# EAGLE schematic midi_controller (EAGLE 9.4.1)
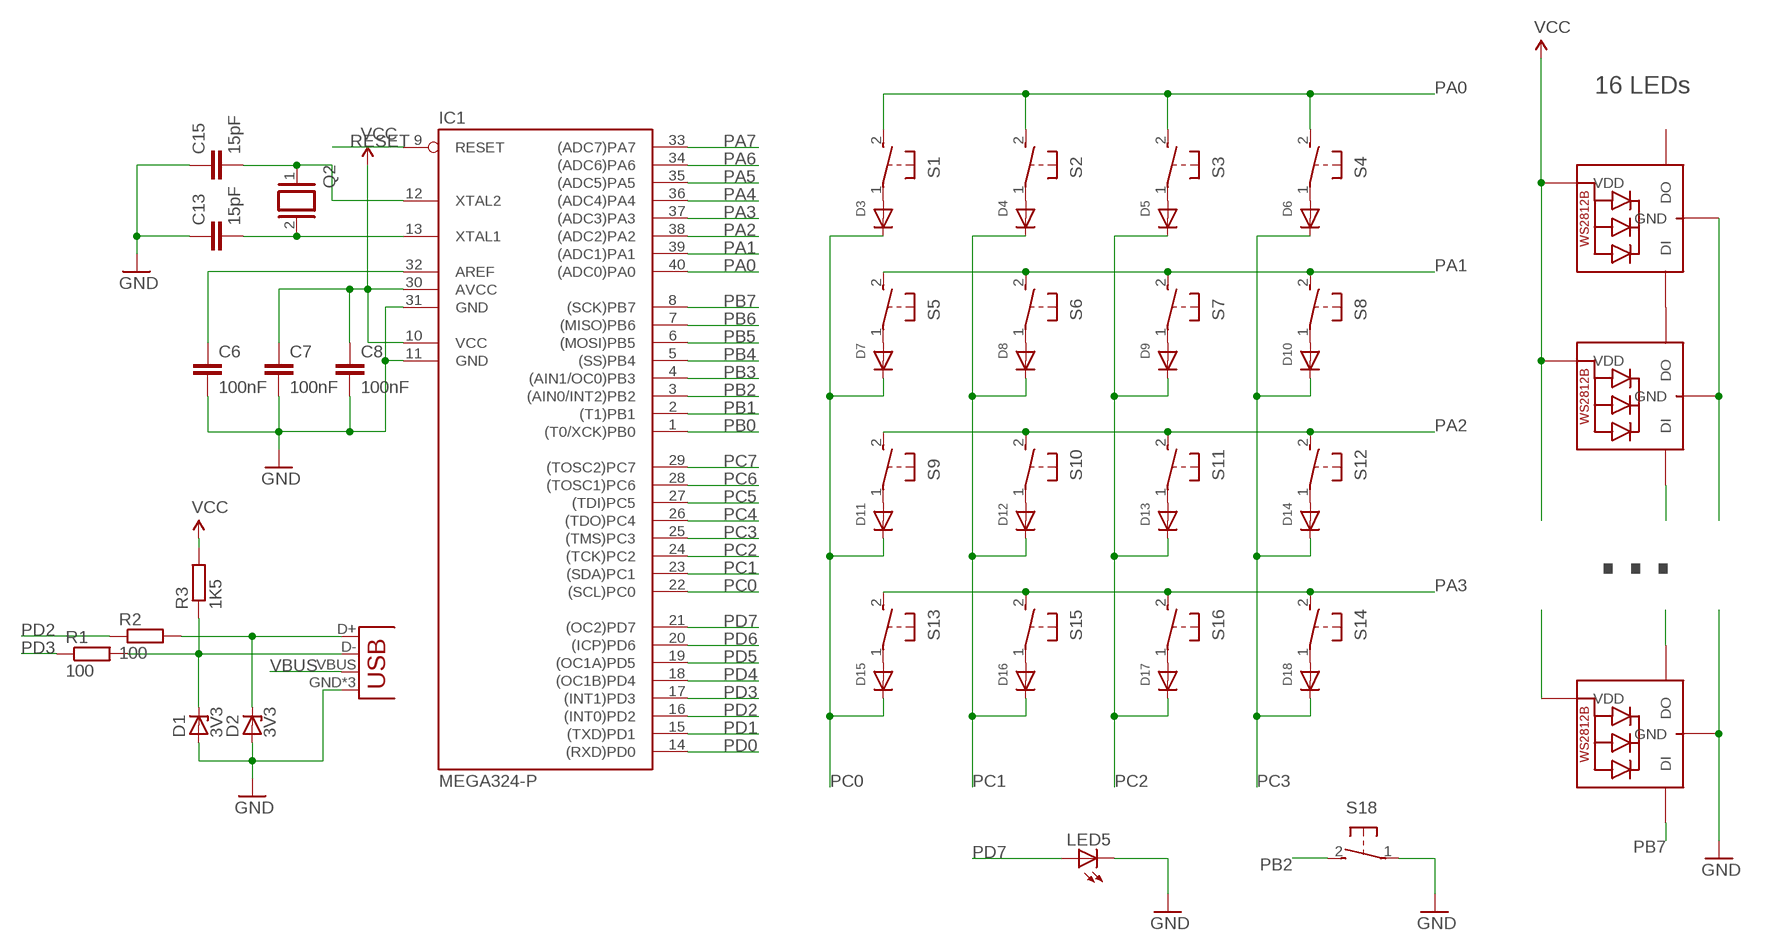
[diagram p0: schematic, sheet 1]

## Parts
C6  100nF  C-EUC_PM  [C025-025X050]
C7  100nF  C-EUC_PM  [C025-025X050]
C8  100nF  C-EUC_PM  [C025-025X050]
C13  15pF  C-EUC_PM  [C025-025X050]
C15  15pF  C-EUC_PM  [C025-025X050]
D1  3V3  ZENER-DIODEDO34-7  [DO34Z7]
D2  3V3  ZENER-DIODEDO34-7  [DO34Z7]
D3  DIODEDO-1N4148  [DO-1N4148]
D4  DIODEDO-1N4148  [DO-1N4148]
D5  DIODEDO-1N4148  [DO-1N4148]
D6  DIODEDO-1N4148  [DO-1N4148]
D7  DIODEDO-1N4148  [DO-1N4148]
D8  DIODEDO-1N4148  [DO-1N4148]
D9  DIODEDO-1N4148  [DO-1N4148]
D10  DIODEDO-1N4148  [DO-1N4148]
D11  DIODEDO-1N4148  [DO-1N4148]
D12  DIODEDO-1N4148  [DO-1N4148]
D13  DIODEDO-1N4148  [DO-1N4148]
D14  DIODEDO-1N4148  [DO-1N4148]
D15  DIODEDO-1N4148  [DO-1N4148]
D16  DIODEDO-1N4148  [DO-1N4148]
D17  DIODEDO-1N4148  [DO-1N4148]
D18  DIODEDO-1N4148  [DO-1N4148]
IC1  MEGA324-P  MEGA16-P  [DIL40]
J2  USBPTH  [USB-B-PTH]
LED1  WS2812B3535  [LED3535]
LED2  WS2812B3535  [LED3535]
LED3  WS2812B3535  [LED3535]
LED5  LED  [SMARTLED-TTW]
Q2  XTAL/S  [QS]
R1  100  R-EU_0204/7  [0204/7]
R2  100  R-EU_0204/7  [0204/7]
R3  1K5  R-EU_0204/7  [0204/7]
S1  31-XXSKINNY  [B3F-31XX-SKINNIER]
S2  31-XXSKINNY  [B3F-31XX-SKINNIER]
S3  31-XXSKINNY  [B3F-31XX-SKINNIER]
S4  31-XXSKINNY  [B3F-31XX-SKINNIER]
S5  31-XXSKINNY  [B3F-31XX-SKINNIER]
S6  31-XXSKINNY  [B3F-31XX-SKINNIER]
S7  31-XXSKINNY  [B3F-31XX-SKINNIER]
S8  31-XXSKINNY  [B3F-31XX-SKINNIER]
S9  31-XXSKINNY  [B3F-31XX-SKINNIER]
S10  31-XXSKINNY  [B3F-31XX-SKINNIER]
S11  31-XXSKINNY  [B3F-31XX-SKINNIER]
S12  31-XXSKINNY  [B3F-31XX-SKINNIER]
S13  31-XXSKINNY  [B3F-31XX-SKINNIER]
S14  31-XXSKINNY  [B3F-31XX-SKINNIER]
S15  31-XXSKINNY  [B3F-31XX-SKINNIER]
S16  31-XXSKINNY  [B3F-31XX-SKINNIER]
S18  31-XXSKINNY  [B3F-31XX-SKINNIER]

## Nets
GND: C6.2 C7.2 C8.2 C13.1 C15.1 D1.A D2.A IC1.11(GND) IC1.31(GND) J2.GND J2.P$1(GND) J2.P$2(GND) LED2.4(GND) LED5.C@1(C) S18.1(P)
N$1: LED1.3(DO) LED3.1(DI)
N$2: D3.A S1.1(P)
N$3: C6.1 IC1.32(AREF)
N$4: C13.2 IC1.13(XTAL1) Q2.2
N$5: C15.2 IC1.12(XTAL2) Q2.1
N$6: D4.A S2.1(P)
N$7: D5.A S3.1(P)
N$8: D6.A S4.1(P)
N$9: LED1.1(DI)
N$10: LED2.3(DO)
N$12: LED2.2(VDD)
N$13: C7.1 C8.1 IC1.10(VCC) IC1.30(AVCC) ; supply symbol labelled VCC
N$14: D2.C J2.D+ R2.2
N$15: D1.C J2.D- R1.2 R3.1
N$16: D7.A S5.1(P)
N$17: D8.A S6.1(P)
N$18: D9.A S7.1(P)
N$19: D10.A S8.1(P)
N$20: LED1.4(GND) LED3.4(GND)
N$21: D11.A S9.1(P)
N$22: D12.A S10.1(P)
N$23: D13.A S11.1(P)
N$24: D14.A S12.1(P)
N$26: D15.A S13.1(P)
N$27: D16.A S15.1(P)
N$28: D17.A S16.1(P)
N$29: D18.A S14.1(P)
PA0: IC1.40((ADC0)PA0) S1.2(S) S2.2(S) S3.2(S) S4.2(S)
PA1: IC1.39((ADC1)PA1) S5.2(S) S6.2(S) S7.2(S) S8.2(S)
PA2: IC1.38((ADC2)PA2) S9.2(S) S10.2(S) S11.2(S) S12.2(S)
PA3: IC1.37((ADC3)PA3) S13.2(S) S14.2(S) S15.2(S) S16.2(S)
PA4: IC1.36((ADC4)PA4)
PA5: IC1.35((ADC5)PA5)
PA6: IC1.34((ADC6)PA6)
PA7: IC1.33((ADC7)PA7)
PB0: IC1.1((T0/XCK)PB0)
PB1: IC1.2((T1)PB1)
PB2: IC1.3((AIN0/INT2)PB2) S18.2(S)
PB3: IC1.4((AIN1/OC0)PB3)
PB4: IC1.5((SS)PB4)
PB5: IC1.6((MOSI)PB5)
PB6: IC1.7((MISO)PB6)
PB7: IC1.8((SCK)PB7) LED2.1(DI)
PC0: D3.C D7.C D11.C D15.C IC1.22((SCL)PC0)
PC1: D4.C D8.C D12.C D16.C IC1.23((SDA)PC1)
PC2: D5.C D9.C D13.C D17.C IC1.24((TCK)PC2)
PC3: D6.C D10.C D14.C D18.C IC1.25((TMS)PC3)
PC4: IC1.26((TDO)PC4)
PC5: IC1.27((TDI)PC5)
PC6: IC1.28((TOSC1)PC6)
PC7: IC1.29((TOSC2)PC7)
PD0: IC1.14((RXD)PD0)
PD1: IC1.15((TXD)PD1)
PD2: IC1.16((INT0)PD2) R2.1
PD3: IC1.17((INT1)PD3) R1.1
PD4: IC1.18((OC1B)PD4)
PD5: IC1.19((OC1A)PD5)
PD6: IC1.20((ICP)PD6)
PD7: IC1.21((OC2)PD7) LED5.A@1(A)
RESET: IC1.9(RESET)
VBUS: J2.VBUS
VCC: LED1.2(VDD) LED3.2(VDD) R3.2
Unconnected: LED3.3(DO)

## Notes on the sheet
- 16 LEDs
- ...

## Library data of the parts
C6-C8 C13 C15 = 0andrei_custom:C-EU: CAPACITOR, European symbol
D1 D2 = diode:ZENER-DIODE: Z-Diode
D3-D18 = adafruit:DIODE: Diode SMADIODE - SMA Surface Mount Package 20V 1A Schottky Diode Digikey: 641-1014-6-ND DO-1N4148 - Through Hole Small Current Diode SOD-123 20V 1 A (.5mV Vf) Schottky Diode - Digikey: MBRX120TPMSCT-ND SOD-323 10V 570mA (.38mV Vf, 3ns) Schottky Diode - Digikey: ZLLS410CT-ND SOD-523 30V 30mA Schottky Diode (RB751S-40TE61) - Digikey: RB751S-40TE61CT-ND SOT23-R/W - SOT23 Package (R = Solder Paste/Reflow Ovens, W = Hand-Soldering) BAT54Film 40V 300mA - Digikey: 497-7162-1-ND
IC1 = atmel:MEGA16-P: MICROCONTROLLER 16 Kbytes FLASH 1 kbytes SRAM 512 bytes EEPROM USART 8-channel 10 bit ADC Source: avr.lbr; MPN: ATMEGA16-16PU; OC_FARNELL: 9171142; OC_NEWARK: 01M6885
J2 = 0andrei_custom:USB: USB Connectors USB-B-PTH is fully proven SKU : PRT-00139 USB-miniB is fully proven SKU : PRT-00587 USB-A-PCB is untested. USB-A-H is throughly reviewed, but untested. Spark Fun Electronics SKU : PRT-00437 USB-B-SMT is throughly reviewed, but untested. Needs silkscreen touching up. USB-A-S has not been used/tested USB-MB-H has not been used/tested
LED1-LED3 = adafruit:WS2812B
LED5 = adafruit:LED: LED OSRAM: - CHIPLED LG R971, LG N971, LY N971, LG Q971, LY Q971, LO R971, LY R971 LH N974, LH R974 LS Q976, LO Q976, LY Q976 LO Q996 - Hyper CHIPLED LW Q18S LB Q993, LB Q99A, LB R99A - SideLED LS A670, LO A670, LY A670, LG A670, LP A670 LB A673, LV A673, LT A673, LW A673 LH A674 LY A675 LS A676, LA A676, LO A676, LY A676, LW A676 LS A679, LY A679, LG A679 - Hyper Micro SIDELED® LS Y876, LA Y876, LO Y876, LY Y876 LT Y87S - SmartLED LW L88C, LW L88S LB L89C, LB L89S, LG L890 LS L89K, LO L89K, LY L89K LS L896, LA L896, LO L896, LY L896 - TOPLED LS T670, LO T670, LY T670, LG T670, LP T670 LSG T670, LSP T670, LSY T670, LOP T670, LYG T670 LG T671, LOG T671, LSG T671 LB T673, LV T673, LT T673, LW T673 LH T674 LS T676, LA T676, LO T676, LY T676, LB T676, LH T676, LSB T676, LW T676 LB T67C, LV T67C, LT T67C, LS T67K, LO T67K, LY T67K, LW E67C LS E67B, LA E67B, LO E67B, LY E67B, LB E67C, LV E67C, LT E67C LW T67C LS T679, LY T679, LG T679 LS T770, LO T770, LY T770, LG T770, LP T770 LB T773, LV T773, LT T773, LW T773 LH T774 LS E675, LA E675, LY E675, LS T675 LS T776, LA T776, LO T776, LY T776, LB T776 LHGB T686 LT T68C, LB T68C - Hyper Mini TOPLED® LB M676 - Mini TOPLED Santana® LG M470 LS M47K, LO M47K, LY M47K Source: http://www.osram.convergy.de/
Q2 = special:XTAL/S: CRYSTAL
R1-R3 = 0andrei_custom:R-EU_: RESISTOR, European symbol
S1-S16 S18 = adafruit:31-XX: OMRON SWITCH Now with beefier pads!